# EAGLE design TRV_CC110L_V1.0 (EAGLE 6.2)
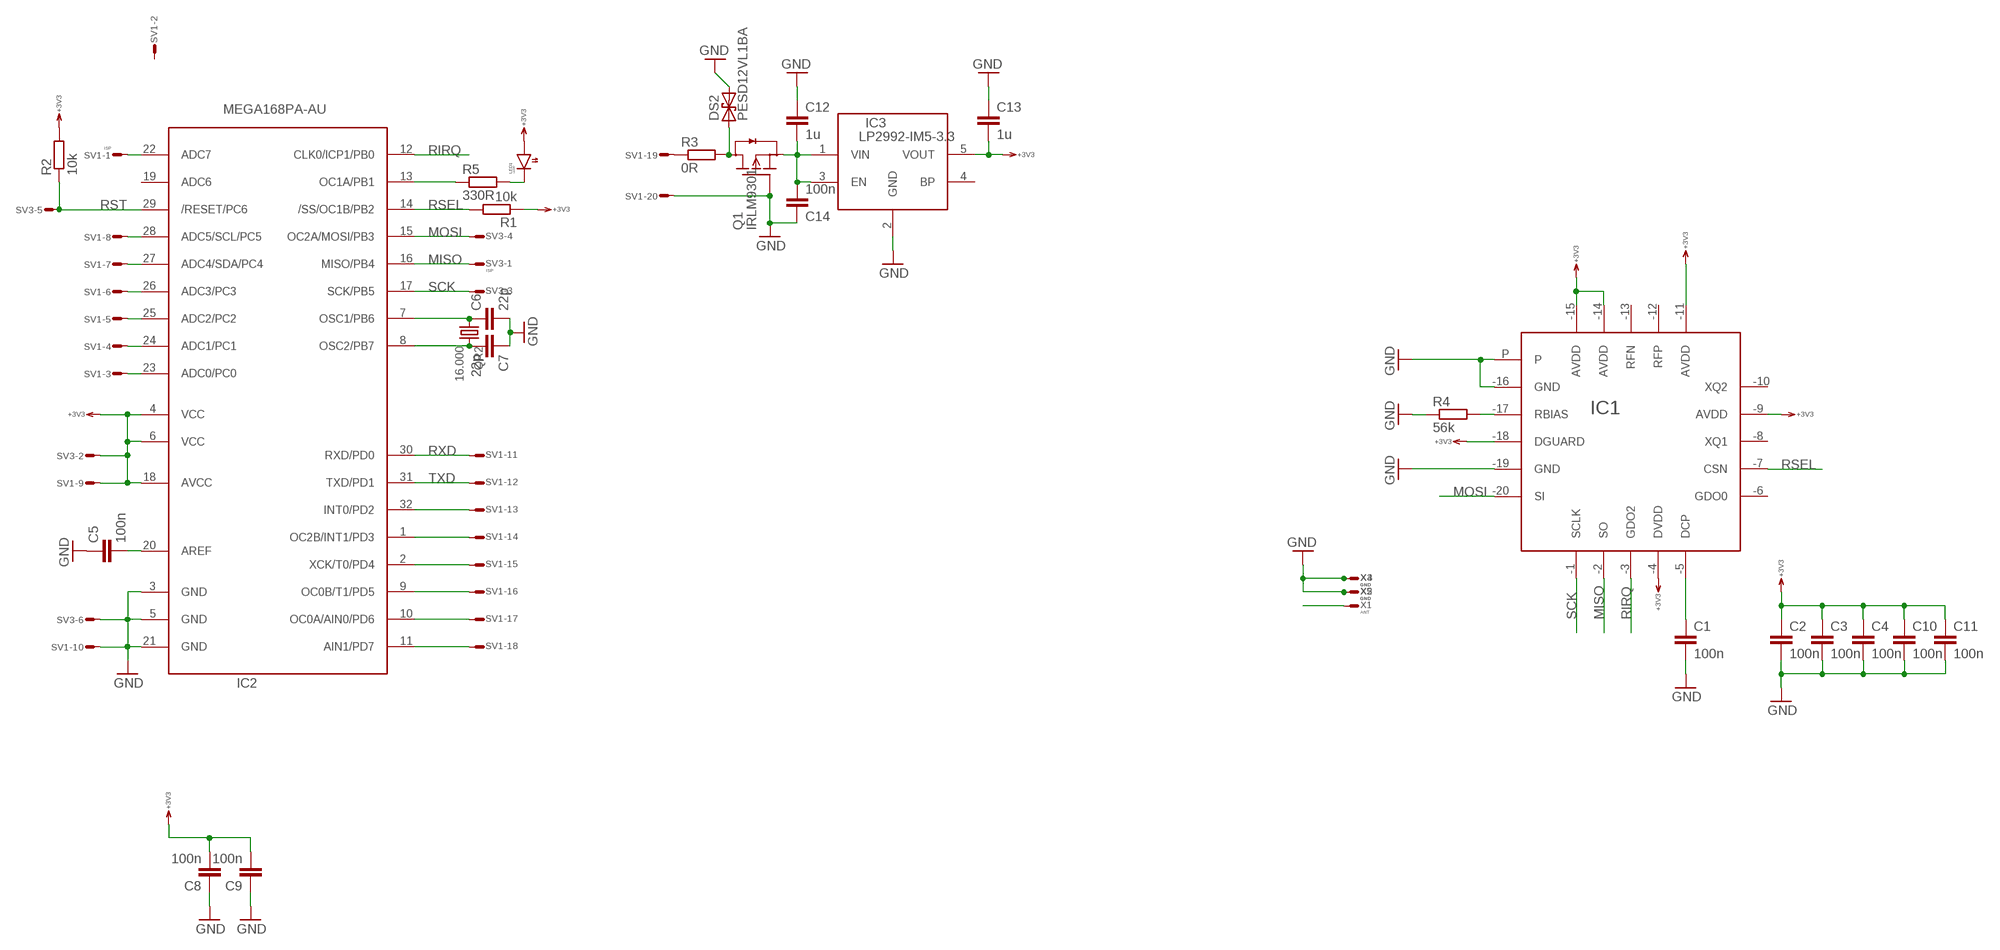
[diagram p0: schematic, sheet 1]

## Parts
C1  100n  C0402  [0402]
C2  100n  C0603  [0603]
C3  100n  C0402  [0402]
C4  100n  C0402  [0402]
C5  100n  C0603  [0603]
C6  22p  C0603  [0603]
C7  22p  C0603  [0603]
C8  100n  C0603  [0603]
C9  100n  C0603  [0603]
C10  100n  C0402  [0402]
C11  100n  C0402  [0402]
C12  1u  C0603  [0603]
C13  1u  C0603  [0603]
C14  100n  C0603  [0603]
DS2  PESD12VL1BA  TVS-U323  [SOD323]
IC1  CC110L  [VQFN20]
IC2  MEGA168PA-AU  MEGA168PA  [TQFP32-08]
IC3  LP2992-IM5-3.3  LDO  [SOT23-5]
LED1  LEDR  LED0603  [0603]
Q1  IRLM9301  FET-PDSOT23  [SOT23]
QR2  16.000  Q49UV  [HC49U-V]
R1  10k  R0603  [0603]
R2  10k  R0603  [0603]
R3  0R  R0603  [0603]
R4  56k  R0402  [0402]
R5  330R  R0603  [0603]
SV1  ISP  ML20E  [ML20]
SV3  ISP  ML6E  [ML6]
X1  ANT  WIREPADS2.54/1.27  [S2.54/1.27]
X2  GND  WIREPADS2.54/1.27  [S2.54/1.27]
X3  GND  WIREPADS2.54/1.27  [S2.54/1.27]
X4  GND  WIREPADS2.54/1.27  [S2.54/1.27]
X5  GND  WIREPADS2.54/1.27  [S2.54/1.27]

## Nets
+3V3: C2.1 C3.1 C4.1 C8.2 C9.2 C10.1 C11.1 C13.2 IC1.-4(DVDD) IC1.-9(AVDD) IC1.-11(AVDD) IC1.-14(AVDD) IC1.-15(AVDD) IC1.-18(DGUARD) IC2.4(VCC) IC2.6(VCC) IC2.18(AVCC) IC3.5(VOUT) LED1.1(A) R1.1 R2.2 SV1.9 SV3.2
GND: C1.2 C2.2 C3.2 C4.2 C5.1 C6.2 C7.1 C8.1 C9.1 C10.2 C11.2 C12.1 C13.1 C14.1 DS2.C IC1.-16(GND) IC1.-19(GND) IC1.P IC2.3(GND) IC2.5(GND) IC2.21(GND) IC3.2(GND) Q1.1(G) R4.1 SV1.10 SV1.20 SV3.6 X2.1(S) X3.1(S) X4.1(S) X5.1(S)
LED: IC2.13(OC1A/PB1) R5.1
MISO: IC1.-2(SO) IC2.16(MISO/PB4) SV3.1
MOSI: IC1.-20(SI) IC2.15(OC2A/MOSI/PB3) SV3.4
N$1: IC1.-17(RBIAS) R4.2
N$2: C1.1 IC1.-5(DCP)
N$3: IC2.22(ADC7) SV1.1
N$5: DS2.A Q1.3(D) R3.2
N$6: C5.2 IC2.20(AREF)
N$12: C12.2 C14.2 IC3.1(VIN) IC3.3(EN) Q1.2(S)
N$18: C6.1 IC2.7(OSC1/PB6) QR2.1
N$19: C7.2 IC2.8(OSC2/PB7) QR2.2
N$21: LED1.2(C) R5.2
N$23: R3.1 SV1.19
N$25: X1.1(S)
PC0: IC2.23(ADC0/PC0) SV1.3
PC1: IC2.24(ADC1/PC1) SV1.4
PC2: IC2.25(ADC2/PC2) SV1.5
PC3: IC2.26(ADC3/PC3) SV1.6
PC4: IC2.27(ADC4/SDA/PC4) SV1.7
PC5: IC2.28(ADC5/SCL/PC5) SV1.8
PD2: IC2.32(INT0/PD2) SV1.13
PD3: IC2.1(OC2B/INT1/PD3) SV1.14
PD4: IC2.2(XCK/T0/PD4) SV1.15
PD5: IC2.9(OC0B/T1/PD5) SV1.16
PD6: IC2.10(OC0A/AIN0/PD6) SV1.17
PD7: IC2.11(AIN1/PD7) SV1.18
RIRQ: IC1.-3(GDO2) IC2.12(CLK0/ICP1/PB0)
RSEL: IC1.-7(CSN) IC2.14(/SS/OC1B/PB2) R1.2
RST: IC2.29(/RESET/PC6) R2.1 SV3.5
RXD: IC2.30(RXD/PD0) SV1.11
SCK: IC1.-1(SCLK) IC2.17(SCK/PB5) SV3.3
TXD: IC2.31(TXD/PD1) SV1.12
Unconnected: IC1.-6(GDO0) IC1.-8(XQ1) IC1.-10(XQ2) IC1.-12(RFP) IC1.-13(RFN) IC2.19(ADC6) IC3.4(BP) SV1.2

## Library data of the parts
C1-C14 = RCL:C: Capacitor SMD
DS2 = Diode:TVS-U: DIODE
IC1 = RF:CC110L
IC2 = atmel:MEGA168P: MCU, 4/8/16k, TQFP32
IC3 = DCDC:LDO
LED1 = Optic:LED
Q1 = Transistor:FET-PD
QR2 = QUARTZ:Q
R1-R5 = RCL:R: Resistor SMD
SV1 = Conn:ML20?E: HARTING
SV3 = Conn:ML6E: HARTING
X1-X5 = Conn:WIREPAD: Wire PAD connect wire on PCB

## Board
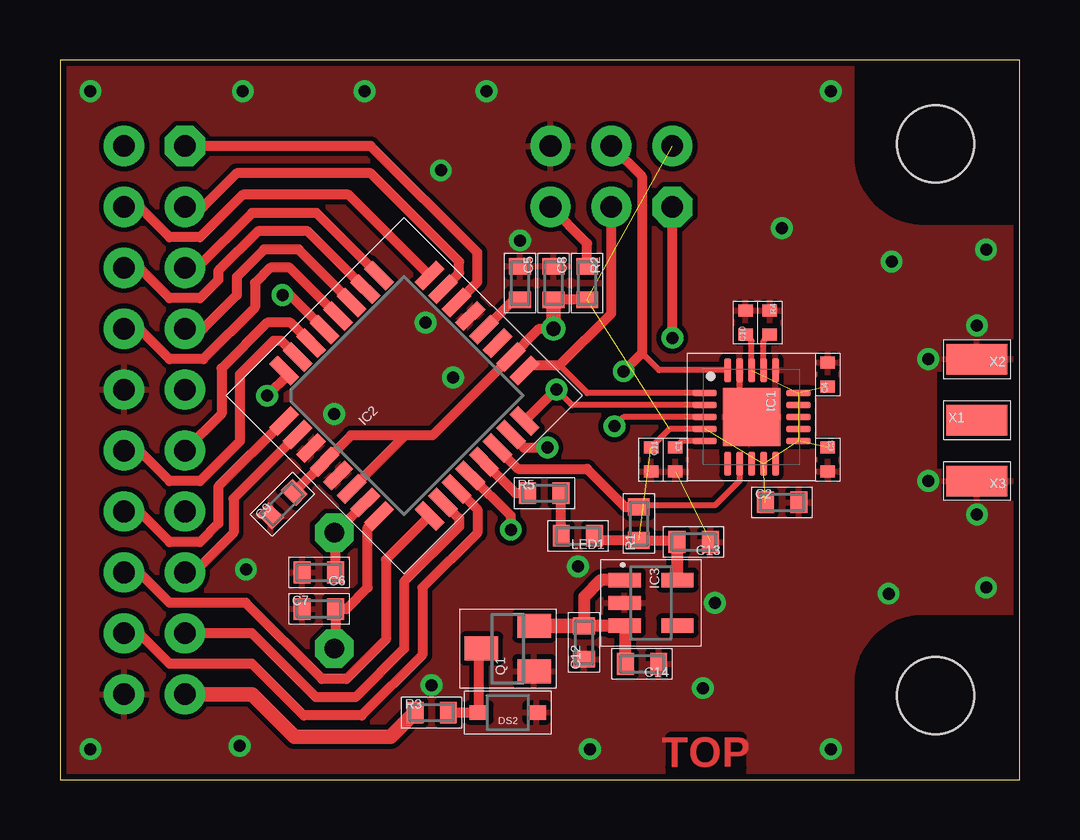
[diagram p1: board, top side]
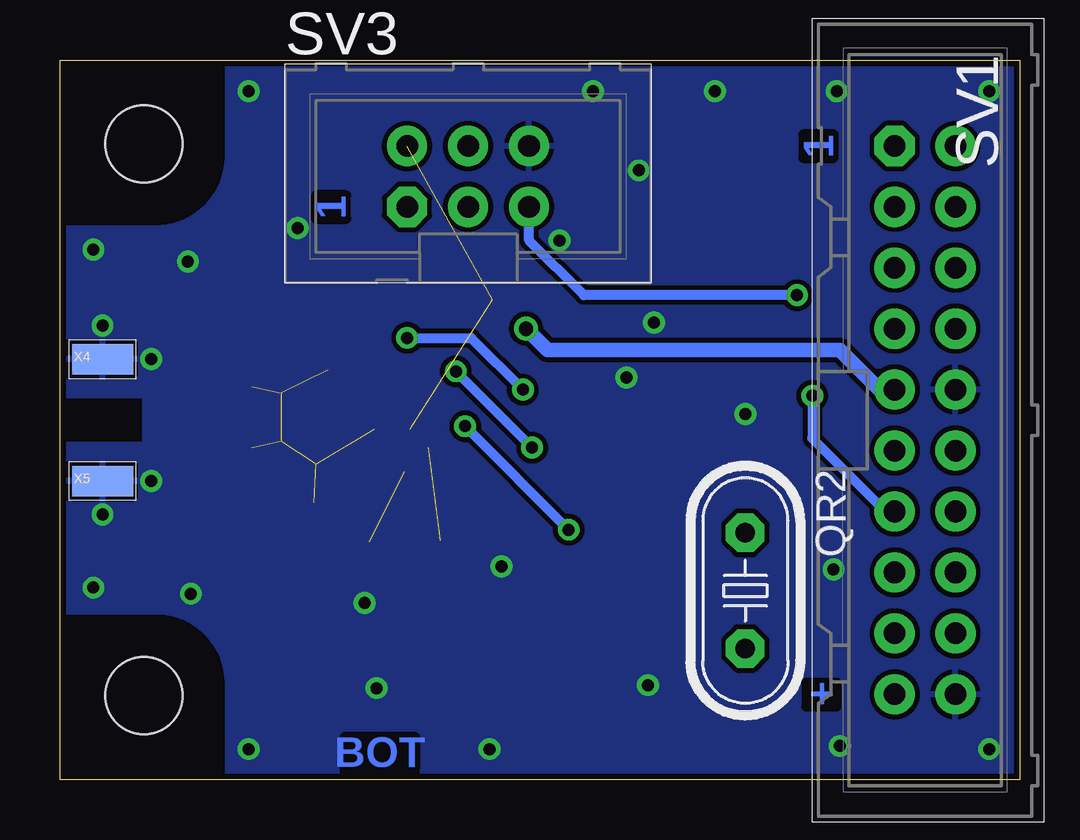
[diagram p2: board, bottom side, seen from below]

Size 40 x 30 mm. Coordinates in mm from the lower left corner, seen from the top.
Outline: 0,0 40,0 40,30 0,30 0,0
Copper layers (1*16): Top 0.035mm / dielectric 1.5mm / Bottom 0.035mm
Design rules "default": minimum track width 8mil, minimum drill 0.3mm, track to track 8mil, track to pad 8mil, pad to pad 8mil, via to via 8mil, smd to smd 8mil, copper to edge 10mil, drill to drill 8mil, minimum pad ring 5mil, minimum via ring 8mil, stop-mask expansion 4mil, vias tented up to drill 25mil, thermal gap 8mil
Holes 3.2 mm at 36.5,26.5 36.5,3.5

### Footprints (pad centres in the part's own frame; a part is rotated, then mirrored left to right if it is on the bottom)
0402 = smd 0.5 x 0.6: 1 -0.5,0; 2 0.5,0
0603 = smd 0.7 x 0.9: 1 -0.697,0; 2 0.697,0
SOD323 = smd 0.8 x 0.6: A 1.2,0; C -1.2,0
VQFN20 = smd 0.28 x 1: -1 -1,-1.95; -2 -0.5,-1.95; -3 0,-1.95; -4 0.5,-1.95; -5 1,-1.95; -11 1,1.95; -12 0.5,1.95; -13 0,1.95; -14 -0.5,1.95; -15 -1,1.95 | smd 1 x 0.28: -6 1.95,-1; -7 1.95,-0.5; -8 1.95,0; -9 1.95,0.5; -10 1.95,1; -16 -1.95,1; -17 -1.95,0.5; -18 -1.95,0; -19 -1.95,-0.5; -20 -1.95,-1 | smd 2.4 x 2.4: P 0,0
TQFP32-08 = smd 1.27 x 0.5: 1 -4.293,2.8; 2 -4.293,2; 3 -4.293,1.2; 4 -4.293,0.4; 5 -4.293,-0.4; 6 -4.293,-1.2; 7 -4.293,-2; 8 -4.293,-2.8; 17 4.293,-2.8; 18 4.293,-2; 19 4.293,-1.2; 20 4.293,-0.4; 21 4.293,0.4; 22 4.293,1.2; 23 4.293,2; 24 4.293,2.8 | smd 0.5 x 1.27: 9 -2.8,-4.293; 10 -2,-4.293; 11 -1.2,-4.293; 12 -0.4,-4.293; 13 0.4,-4.293; 14 1.2,-4.293; 15 2,-4.293; 16 2.8,-4.293; 25 2.8,4.293; 26 2,4.293; 27 1.2,4.293; 28 0.4,4.293; 29 -0.4,4.293; 30 -1.2,4.293; 31 -2,4.293; 32 -2.8,4.293
SOT23-5 = smd 0.6 x 1.35: 1 -0.95,-1.101; 2 0,-1.101; 3 0.95,-1.101; 4 0.95,1.101; 5 -0.951,1.101
SOT23 = smd 1 x 1.4: 1 -0.95,-1.1; 2 0.95,-1.1; 3 0,1.1
HC49U-V = drill 0.813 pad 1.6 octagon: 1 -2.413,0; 2 2.413,0
ML20 = drill 0.9 pad 1.676 octagon: 1 -11.43,-1.27 | drill 0.9 pad 1.676: 2 -11.43,1.27; 3 -8.89,-1.27; 4 -8.89,1.27; 5 -6.35,-1.27; 6 -6.35,1.27; 7 -3.81,-1.27; 8 -3.81,1.27; 9 -1.27,-1.27; 10 -1.27,1.27; 11 1.27,-1.27; 12 1.27,1.27; 13 3.81,-1.27; 14 3.81,1.27; 15 6.35,-1.27; 16 6.35,1.27; 17 8.89,-1.27; 18 8.89,1.27; 19 11.43,-1.27; 20 11.43,1.27
ML6 = drill 0.9 pad 1.676 octagon: 1 -2.54,-1.27 | drill 0.9 pad 1.676: 2 -2.54,1.27; 3 0,-1.27; 4 0,1.27; 5 2.54,-1.27; 6 2.54,1.27
S2.54/1.27 = smd 1.27 x 2.54: 1 0,0

### Placement (x,y rotation side)
C1  25.65,13.34 270 top
C2  30.1,11.56 0 top
C3  32,13.34 270 top
C4  32,16.89 90 top
C5  19.18,20.7 270 top
C6  10.79,8.64 180 top
C7  10.79,7.11 0 top
C8  20.57,20.7 270 top
C9  9.27,11.48 45 top
C10  28.57,19.05 90 top
C11  24.64,13.34 270 top
C12  21.84,5.71 90 top
C13  26.42,9.91 180 top
C14  24.27,4.82 180 top
DS2  18.67,2.79 180 top
IC1  28.83,15.11 270 top
IC2  14.35,16 45 top
IC3  24.64,7.37 270 top
LED1  21.59,10.16 180 top
Q1  18.67,5.46 90 top
QR2  11.43,7.87 270 bottom
R1  24.13,10.67 90 top
R2  21.97,20.7 270 top
R3  15.49,2.79 0 top
R4  29.59,19.05 270 top
R5  20.19,11.94 0 top
SV1  3.94,14.99 270 bottom
SV3  22.99,25.15 0 bottom
X1  38.23,14.99 270 top
X2  38.23,17.53 90 top
X3  38.23,12.45 90 top
X4  38.23,17.53 270 bottom
X5  38.23,12.45 270 bottom

### Tracks (layer width: path | path; a pad name or v marks a point on that pad's centre or on a via)
+3V3  (via drill 0.6)  (11 unrouted)
  Top 0.254: IC1.-18 28.83,18.3 C10.1 | IC1.-4 25.42,14.61 C11.1
  Top 0.406: C9.2 IC2.4 12.13,14.35 14.35,14.35 | 14.35,14.35 15.53,14.35 IC2.18 19.97,18.8 v20.57,18.8 | IC2.6 14.35,14.3 14.35,14.35 | R2.2 C8.2 | LED1.1 22.48,9.97 R1.1 25.65,9.97 C13.2
  Top 0.508: C13.2 25.72,8.34 IC3.5
  Top 0.61: C8.2 v20.57,18.8
  Bottom 0.61: v20.57,18.8 19.68,17.91 7.49,17.91 5.84,16.26 SV1.9
GND  (via drill 0.5)  (1 unrouted)
  Top 0.254: IC1.-19 28.33,15.61 IC1.P
  other vias: 7.75,8.76 21.59,8.89 38.23,18.92 38.23,11.05 22.1,1.27 36.2,12.45 36.2,17.53 7.62,28.7 12.7,28.7 17.78,28.7 32.13,28.7 30.1,22.99 38.61,22.1 38.61,8 32.13,1.27 26.8,3.81 34.67,21.59 15.88,25.4 34.54,7.75 15.49,3.94 7.49,1.4 27.3,7.37 19.18,22.48 11.43,15.24 16.38,16.76 15.24,19.05 1.27,28.7 1.27,1.27
  pour Top: 0,0 33,0 33,4 arc-90 36,7 40,7 40.01,12.83 36.45,12.83 36.45,17.14 40,17.14 40,23 36,23 arc-90 33,26 33,30 0,30
  pour Bottom: 0,0 33,0 33,4 arc-90 36,7 40,7 40.01,13.97 36.45,13.97 36.45,16 40,16 40,23 36,23 arc-90 33,26 33,30 0,30
LED
  Top 0.406: IC2.13 18.98,11.94 R5.1
MISO  (via drill 0.5)
  Top 0.254: IC1.-2 21.34,15.61 v20.7,16.26
  Top 0.406: v25.53,18.41 SV3.1 | IC2.16 20.68,16.26 v20.7,16.26
  Bottom 0.406: v25.53,18.41 22.86,18.41 v20.7,16.26
MOSI  (via drill 0.5)
  Top 0.254: IC1.-20 24.97,17.06 24.26,17.78
  Top 0.406: IC2.15 19.34,13.84 v20.32,13.84 | SV3.4 24.26,25.15 24.26,17.78 v23.5,17.02
  Bottom 0.406: v23.5,17.02 v20.32,13.84
N$1
  Top 0.254: IC1.-17 29.33,18.29 R4.2
N$2
  Top 0.254: IC1.-5 25.92,14.11 C1.1
N$3
  Top 0.406: IC2.22 17.4,20.75 17.4,21.97 12.95,26.42 SV1.1
N$5
  Top 0.406: R3.2 DS2.A 17.47,5.36 Q1.3
N$6
  Top 0.406: IC2.20 18.92,20 C5.2
N$12
  Top 0.406: IC3.1 23.94,8.32
  Top 0.508: C14.2 23.57,6.38 IC3.3 C12.2 21.84,7.62 22.54,8.32 IC3.1
  Top 0.61: C12.2 Q1.2
N$18
  Top 0.406: IC2.7 11.46,10.29 QR2.1 11.49,10.22 C6.1
N$19
  Top 0.406: IC2.8 12.83,10.52 12.83,8 11.94,7.11 C7.2 11.49,5.52 QR2.2
N$21
  Top 0.406: LED1.2 R5.2
N$23
  Top 0.61: SV1.19 8,3.56 9.78,1.78 13.78,1.78 R3.1
N$25
  Top 0.61: 38.04,14.8 X1.1
PC0
  Top 0.406: IC2.23 16.64,21.12 16.64,21.59 12.95,25.27 7.37,25.27 5.97,23.88 SV1.3
PC1
  Top 0.406: IC2.24 12.04,24.38 7.62,24.38 5.84,22.61 4.57,22.61 3.3,23.88 SV1.4
PC2
  Top 0.406: SV1.5 5.71,21.34 8,23.62 10.69,23.62 IC2.25
PC3
  Top 0.406: SV1.6 3.3,21.34 4.57,20.07 5.84,20.07 6.6,20.83 6.6,21.21 8.26,22.86 10.32,22.86 IC2.26
PC4
  Top 0.406: SV1.7 5.97,18.8 7.37,20.19 7.37,20.95 8.51,22.1 9.95,22.1 IC2.27
PC5
  Top 0.406: SV1.8 3.3,18.8 4.57,17.53 5.97,17.53 8.13,19.68 8.13,20.7 8.76,21.34 9.58,21.34 IC2.28
PD2  (via drill 0.5)
  Top 0.406: IC2.32 9.36,17.06 9.53,16.89 v8.64,16
  Bottom 0.406: v8.64,16 8.64,14.22 5.59,11.18 SV1.13
PD3
  Top 0.406: IC2.1 6.6,12.21 6.6,10.67 5.84,9.91 4.57,9.91 3.3,11.18 SV1.14
PD4
  Top 0.406: IC2.2 7.24,11.72 7.24,10.29 5.59,8.64 SV1.15
PD5
  Top 0.406: IC2.9 13.59,9.17 13.59,5.84 11.94,4.19 10.92,4.19 7.75,7.37 4.57,7.37 3.3,8.64 SV1.16
PD6
  Top 0.406: IC2.10 16.64,10.89 16.64,10.54 14.35,8.26 14.35,5.46 12.32,3.43 10.67,3.43 8,6.1 SV1.17
PD7
  Top 0.406: IC2.11 17.4,11.26 17.4,10.29 15.11,8 15.11,5.21 12.57,2.67 10.16,2.67 8,4.83 4.57,4.83 3.3,6.1 SV1.18
RIRQ  (via drill 0.5)
  Top 0.254: IC1.-3 23.5,15.11 v23.11,14.73
  Top 0.406: v18.8,10.41 18.8,10.99 IC2.12
  Bottom 0.406: v23.11,14.73 v18.8,10.41
RSEL
  Top 0.254: IC1.-7 28.33,12.45 27.3,11.43 24.2,11.43 R1.2
  Top 0.406: IC2.14 19.1,12.95 21.97,12.95 23.56,11.37 R1.2
RST  (via drill 0.5)
  Top 0.406: IC2.29 9.59,20.19 v9.27,20.19 | R2.1 21.97,22.35 SV3.5
  Bottom 0.406: v9.27,20.19 18.16,20.19 20.45,22.48 SV3.5
RXD
  Top 0.406: IC2.30 9.61,19.05 8.64,19.05 6.73,17.14 6.73,15.24 SV1.11
SCK
  Top 0.254: IC1.-1 21.99,16.11 20.83,17.27
  Top 0.406: IC2.17 19.37,17.08 19.56,17.27 20.83,17.27 22.99,19.43 SV3.3
TXD
  Top 0.406: IC2.31 9.24,18.29 8.89,18.29 7.49,16.89 7.49,14.1 5.84,12.45 4.57,12.45 3.3,13.72 SV1.12

### Text on the board
Top: TOP
Bottom: 1 | 1 | + | BOT